# Altium schematic sheet Buzzer.SchDoc
size A
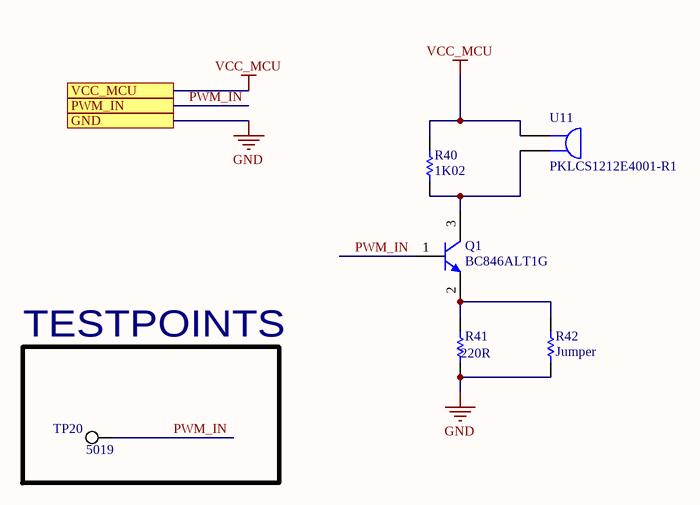
[diagram p0: Buzzer.SchDoc]

## Parts
Q1  BC846ALT1G  [ONSC-SOT-23-3-318-08_V]
R40  1K02  [RESC0603(1608)_N]
R41  220R  [RESC0805(2012)_L]
R42  Jumper  [RESC0603(1608)_N]
TP20  5019  [KSTN-5019_V]
U11  PKLCS1212E4001-R1  [MURA-PKLCS1212E4001-R1-2_V]

## Blocks framed on the sheet
TESTPOINTS: TP20

## Ports
GND, PWM_IN, VCC_MCU

## Nets
GND: R41.1 R42.1 ; port GND
VCC_MCU: R40.2 U11.1 ; port VCC_MCU
PWM_IN: Q1.1(B) TP20.1 ; port PWM_IN
NetQ1_2: Q1.2(E) R41.2 R42.2
NetQ1_3: Q1.3(C) R40.1 U11.2

## Library data of the parts
Q1 = CMP-1048-00774-1: General Purpose Transistor, NPN Silicon, 3-Pin SOT-23, Pb-Free, Tape and Reel; Manufacturer: On Semiconductor; fT Min (MHz): 100; IC Continuous (A): 0.1; Polarity: NPN; PackageVersion: Rev. AP, 11/2009; RoHS: TRUE; ComponentLink1URL: http://www.onsemi.com/; DatasheetVersion: Rev. 11; ComponentLink3URL: http://www.onsemi.cn/pub_link/Collateral/318-08.PDF; Mounting Technology: Surface Mount; ComponentLink2Description: Datasheet; PartNumber: BC846ALT1G; ComponentLink1Description: Manufacturer URL; ComponentLink3Description: Package Specification; PackageReference: SOT-23-3-318-08; ComponentLink2URL: http://www.onsemi.cn/pub_link/Collateral/BC846ALT1-D.PDF; PackageDescription: 3-Pin Small Outline Transistor, Body 2.92 x 1.3 mm, Pitch 0.95 mm; Packing: Tape and Reel
R40 = CMP-1012-00511-1: 1K02 0.1W 1% 0603 (1608 Metric)  SMD; Value: 1020.00 Ohm; Case-EIA: 0603; Case-Metric: 1608; Technology: SMT; Power: 0.1 W; Tolerance: 1 %
R41 = CMP-1013-00058-1: 220R 0.125W 5% 0805 (2012 Metric)  SMD; Value: 220.00 Ohm; Case-Metric: 2012; Case-EIA: 0805; Technology: SMT; Power: 0.125 W; Tolerance: 5 %
R42 = CMP-1012-00001-1: Jumper 0603 (1608 Metric); Case-Metric: 1608; Value: 0.00 Ohm; Power: None; Case-EIA: 0603; Technology: SMT; Tolerance: None
TP20 = CMP-1672-00008-1: Test Point, 1 Position SMD, RoHS, Tape and Reel; ComponentLink1Description: Manufacturer URL; Package Quantity: 1000; DatasheetVersion: 03/2014; Packaging: Tape and Reel; ComponentLink2URL: http://www.keyelco.com/product-pdf.cfm?p=1357; ComponentLink1URL: http://www.keyelco.com/; Mount: Surface Mount; Contact Plating: Silver; PackageDescription: 1-Pin Surface Mount Device, Body 3.81 x 2.03 mm; Pins: 1; RoHSCompliant: True; Mounting Technology: Surface Mount; ComponentLink2Description: Datasheet; PackageReference: 5019
U11 = CMP-2000-05277-1: Piezoelectric Sound Component, 4 KHz, -20 to 70 degC, 2-Pin SMD, RoHS, Tape and Reel; Manufacturer: Murata; Port Location: Side; Operating Mode: Continuous; Voltage Range: 25V(Max); Driver Circuitry: Transducer,ExternallyDriven; Other Names: 490-4683-6; Input Type: peak-peakSignal; Voltage - Rated: 3Vp-p; Online Catalog: PKSeries; Frequency: 4kHz; Featured Product: SMDPiezoelectricSounders; Washable: No; Current - Supply: -; Datasheet Version: Jul-12; Packaging: Digi-Reel; Category: AudioProducts; Standard Package: 1; Manufacturer URL: http://www.murata.com/; Mounting Type: SurfaceMount; Technology: Piezo; Sound Pressure Level: -; Termination: SolderPads; Family: Buzzers; Capacitance @ Frequency: -; Size / Dimension: 12.0mmLx12.0mmWx3.0mmH; Operating Temperature: -20degC~70degC; Series: PK; Datasheet URL: https://datasheet.ciiva.com/34302/1874527-34302938.pdf